# Altium schematic sheet 06.RK3399 USB.SchDoc
size A4; SheetNumber: 6; SheetTotal: 10
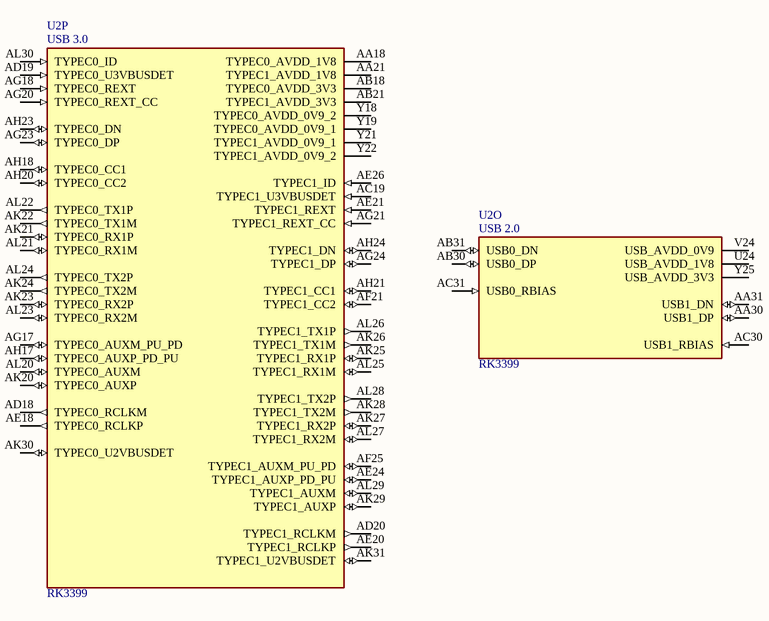
[diagram p0: 06.RK3399 USB.SchDoc]

## Parts
U2  RK3399  [BGA828C65P31X31_2100X2100X161N]  (parts O,P of 32)

## Nets

Not connected (* = marked no-connect by the designer): U2 AA18(TYPEC0_AVDD_1V8) AA21(TYPEC1_AVDD_1V8) AA30(USB1_DP) AA31(USB1_DN) AB18(TYPEC0_AVDD_3V3) AB21(TYPEC1_AVDD_3V3) AB30(USB0_DP) AB31(USB0_DN) AC19(TYPEC1_U3VBUSDET) AC30(USB1_RBIAS) AC31(USB0_RBIAS) AD18(TYPEC0_RCLKM) AD19(TYPEC0_U3VBUSDET) AD20(TYPEC1_RCLKM) AE18(TYPEC0_RCLKP) AE20(TYPEC1_RCLKP) AE21(TYPEC1_REXT) AE24(TYPEC1_AUXP_PD_PU) AE26(TYPEC1_ID) AF21(TYPEC1_CC2) AF25(TYPEC1_AUXM_PU_PD) AG17(TYPEC0_AUXM_PU_PD) AG18(TYPEC0_REXT) AG20(TYPEC0_REXT_CC) AG21(TYPEC1_REXT_CC) AG23(TYPEC0_DP) AG24(TYPEC1_DP) AH17(TYPEC0_AUXP_PD_PU) AH18(TYPEC0_CC1) AH20(TYPEC0_CC2) AH21(TYPEC1_CC1) AH23(TYPEC0_DN) AH24(TYPEC1_DN) AK20(TYPEC0_AUXP) AK21(TYPEC0_RX1P) AK22(TYPEC0_TX1M) AK23(TYPEC0_RX2P) AK24(TYPEC0_TX2M) AK25(TYPEC1_RX1P) AK26(TYPEC1_TX1M) AK27(TYPEC1_RX2P) AK28(TYPEC1_TX2M) AK29(TYPEC1_AUXP) AK30(TYPEC0_U2VBUSDET) AK31(TYPEC1_U2VBUSDET) AL20(TYPEC0_AUXM) AL21(TYPEC0_RX1M) AL22(TYPEC0_TX1P) AL23(TYPEC0_RX2M) AL24(TYPEC0_TX2P) AL25(TYPEC1_RX1M) AL26(TYPEC1_TX1P) AL27(TYPEC1_RX2M) AL28(TYPEC1_TX2P) AL29(TYPEC1_AUXM) AL30(TYPEC0_ID) U24(USB_AVDD_1V8) V24(USB_AVDD_0V9) Y18(TYPEC0_AVDD_0V9_2) Y19(TYPEC0_AVDD_0V9_1) Y21(TYPEC1_AVDD_0V9_1) Y22(TYPEC1_AVDD_0V9_2) Y25(USB_AVDD_3V3)

## Notes on the sheet
- (in symbol RK3399, part O) USB 2.0
- (in symbol RK3399, part P) USB 3.0

## Library data of the parts
U2 = RK3399: RK3399 ROCK Pi 4 Model A 2GB - ARMÂ® CortexÂ®-A53, CortexÂ®-A72 MPU Embedded Evaluation Board; MF: Rockchip; SnapEDA_Link: https://www.snapeda.com/parts/RK3399/Fuzhou+Rockchip+Electronics+Co/view-part/?ref=snap; Package: Seeed Technology; MP: RK3399; Check_prices: https://www.snapeda.com/parts/RK3399/Fuzhou+Rockchip+Electronics+Co/view-part/?ref=eda; Price: None; Value: *; Availability: Not in stock